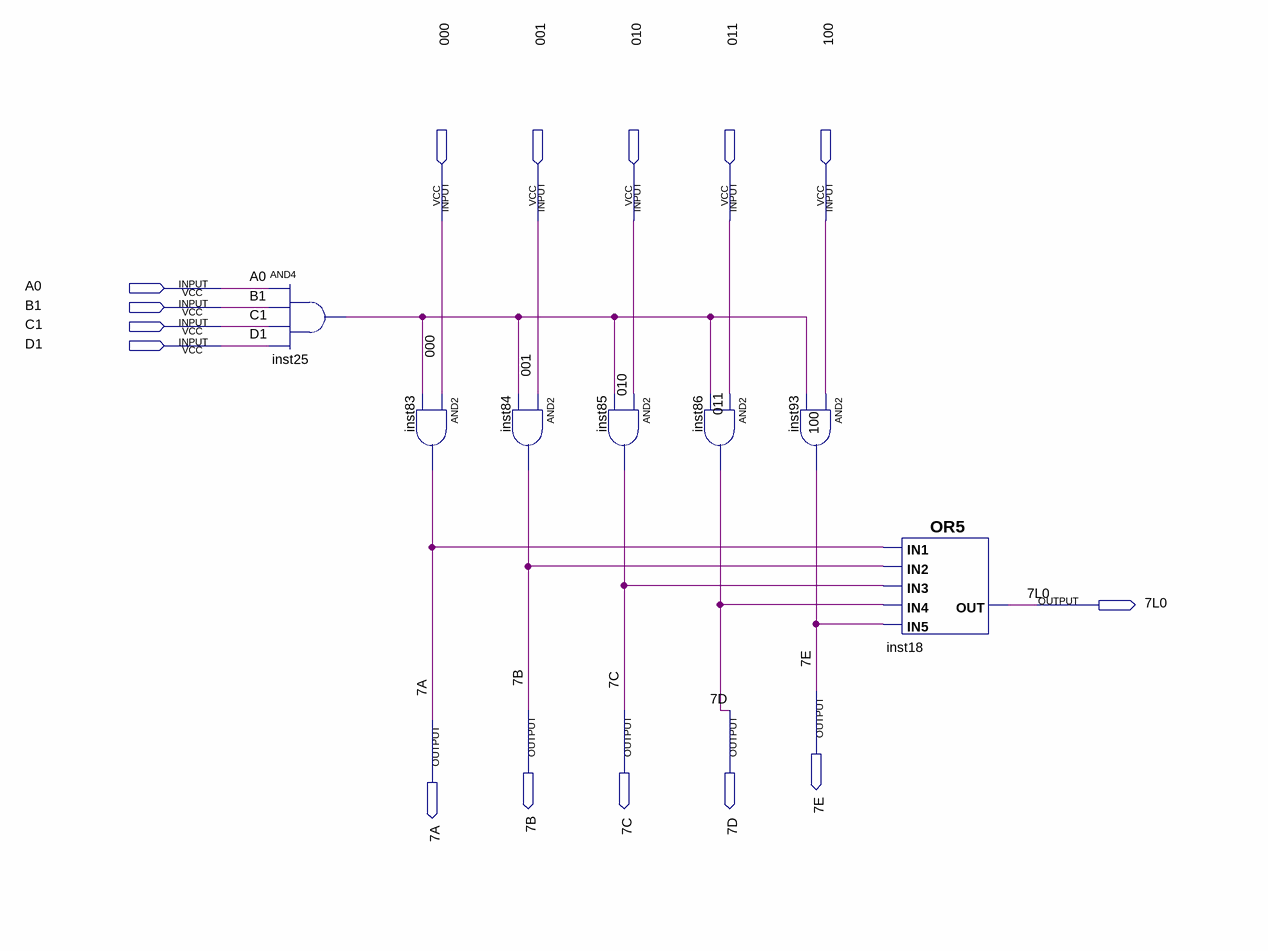
[diagram p0: schematic sheet]
// Quartus schematic carac7.bdf as structural Verilog: 7 symbols, 15 pins
module carac7 (
  input  \000 ,
  input  \001 ,
  input  \010 ,
  input  \011 ,
  input  \100 ,
  input  A0,
  input  B1,
  input  C1,
  input  D1,
  output \7L0 ,
  output \7E ,
  output \7B ,
  output \7C ,
  output \7D ,
  output \7A 
);

  wire inst25_out;

  and inst25 (inst25_out, A0, B1, C1, D1);
  and inst83 (\7A , \000 , inst25_out);
  and inst84 (\7B , \001 , inst25_out);
  and inst85 (\7C , \010 , inst25_out);
  and inst86 (\7D , \011 , inst25_out);
  and inst93 (\7E , \100 , inst25_out);
  or inst18 (\7L0 , \7A , \7B , \7C , \7D , \7E );
endmodule
